# EAGLE design led driver3 (EAGLE 6.2)
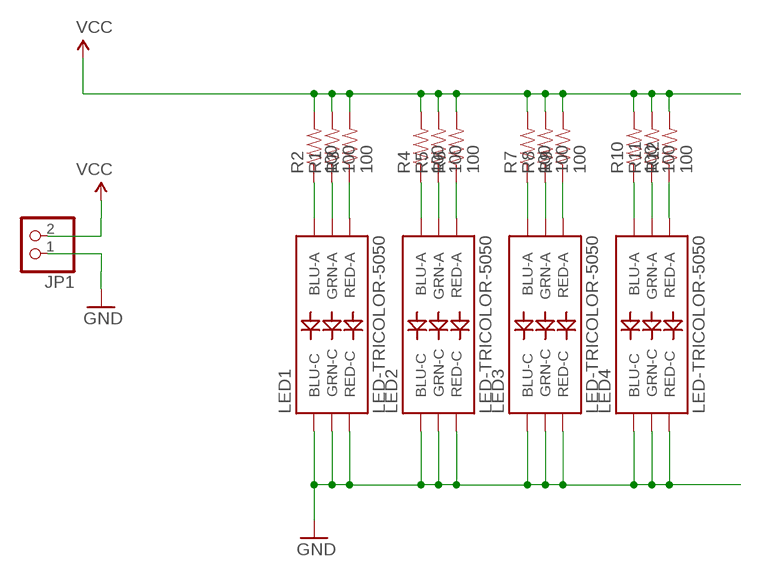
[diagram p0: schematic, sheet 1]

## Parts
JP1  PINHD-1X2  [1X02]
LED1  LED-TRICOLOR-5050  [LED-TRICOLOR-5050]
LED2  LED-TRICOLOR-5050  [LED-TRICOLOR-5050]
LED3  LED-TRICOLOR-5050  [LED-TRICOLOR-5050]
LED4  LED-TRICOLOR-5050  [LED-TRICOLOR-5050]
R1  100  RESISTOR0603-RES  [0603-RES]
R2  100  RESISTOR0603-RES  [0603-RES]
R3  100  RESISTOR0603-RES  [0603-RES]
R4  100  RESISTOR0603-RES  [0603-RES]
R5  100  RESISTOR0603-RES  [0603-RES]
R6  100  RESISTOR0603-RES  [0603-RES]
R7  100  RESISTOR0603-RES  [0603-RES]
R8  100  RESISTOR0603-RES  [0603-RES]
R9  100  RESISTOR0603-RES  [0603-RES]
R10  100  RESISTOR0603-RES  [0603-RES]
R11  100  RESISTOR0603-RES  [0603-RES]
R12  100  RESISTOR0603-RES  [0603-RES]

## Nets
GND: JP1.1 LED1.4(BLU-C) LED1.5(RED-C) LED1.6(GRN-C) LED2.4(BLU-C) LED2.5(RED-C) LED2.6(GRN-C) LED3.4(BLU-C) LED3.5(RED-C) LED3.6(GRN-C) LED4.4(BLU-C) LED4.5(RED-C) LED4.6(GRN-C)
N$1: LED2.3(BLU-A) R4.1
N$2: LED2.1(GRN-A) R5.1
N$3: LED2.2(RED-A) R6.1
N$4: LED3.3(BLU-A) R7.1
N$5: LED3.1(GRN-A) R8.1
N$6: LED3.2(RED-A) R9.1
N$7: LED4.3(BLU-A) R10.1
N$8: LED4.1(GRN-A) R11.1
N$9: LED4.2(RED-A) R12.1
N$20: LED1.3(BLU-A) R2.1
N$21: LED1.1(GRN-A) R1.1
N$22: LED1.2(RED-A) R3.1
VCC: JP1.2 R1.2 R2.2 R3.2 R4.2 R5.2 R6.2 R7.2 R8.2 R9.2 R10.2 R11.2 R12.2

## Library data of the parts
JP1 = pinhead:PINHD-1X2: PIN HEADER
LED1-LED4 = SparkFun:LED-TRICOLOR-5050
R1-R12 = SparkFun:RESISTOR: Resistor Basic schematic elements and footprints for 0603, 1206, and PTH resistors.

## Board
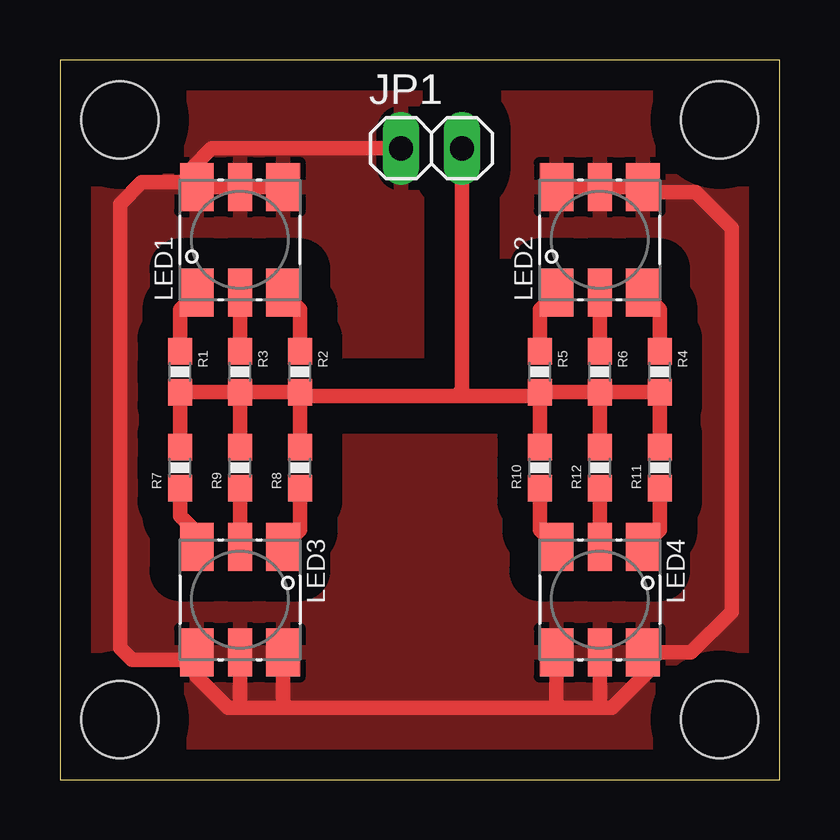
[diagram p1: board, top side]

Size 30 x 30 mm. Coordinates in mm from the lower left corner, seen from the top.
Outline: 0,0 30,0 30,30 0,30 0,0
Copper layers (1*16): Top 0.035mm / dielectric 1.5mm / Bottom 0.035mm
Design rules: minimum track width 10mil, minimum drill 24mil, track to track 8mil, track to pad 8mil, pad to pad 8mil, via to via 8mil, smd to smd 8mil, copper to edge 40mil, drill to drill 8mil, minimum pad ring 10mil, minimum via ring 8mil, stop-mask expansion 4mil, vias tented up to drill 0mil, thermal gap 10mil
Holes 3.2 mm at 2.5,2.5 2.5,27.5 27.5,27.5 27.5,2.5

### Footprints (pad centres in the part's own frame; a part is rotated, then mirrored left to right if it is on the bottom)
1X02 = drill 1.016 long: 1 -1.27,0; 2 1.27,0
LED-TRICOLOR-5050 = smd 2 x 1.4: 1 -2.2,1.8; 3 -2.2,-1.8; 4 2.2,-1.8; 6 2.2,1.8 | smd 2 x 1: 2 -2.2,0; 5 2.2,0
0603-RES = smd 1.1 x 1: 1 -0.85,0; 2 0.85,0

### Placement (x,y rotation side)
JP1  15.49,26.32 0 top
LED1  7.5,22.5 90 top
LED2  22.5,22.5 90 top
LED3  7.5,7.5 270 top
LED4  22.5,7.5 270 top
R1  5,17 270 top
R2  10,17 270 top
R3  7.5,17 270 top
R4  25,17 270 top
R5  20,17 270 top
R6  22.5,17 270 top
R7  5,13 90 top
R8  10,13 90 top
R9  7.5,13 90 top
R10  20,13 90 top
R11  25,13 90 top
R12  22.5,13 90 top

### Tracks (layer width: path | path; a pad name or v marks a point on that pad's centre or on a via)
GND
  Top 0.61: JP1.1 6.32,26.32 5.5,25.5 5.5,24.9 | 5.5,24.9 LED1.6 LED1.5 LED1.4 | 7.5,3 7,3 5.7,4.3 LED3.4 5.4,5 3,5 2.5,5.5 2.5,24 3.4,24.9 5.5,24.9 | 7.5,3 9.5,3 | 9.5,3 20.5,3 | 20.5,3 22.5,3 | 22.5,3 23,3 24.5,4.5 24.5,5.1 LED4.6 26.3,5.3 28,7 28,23 26.5,24.5 24.5,24.5 LED2.4 LED2.5 LED2.6 | LED4.5 22.5,3 | LED4.4 20.7,3.2 20.5,3 | LED3.6 9.3,3.2 9.5,3 | LED3.5 7.5,3
  pour Top (isolate 1.27): 0,30 30,30 30,0 0,0
N$1
  Top 0.61: R4.1 25,19.6 LED2.3
N$2
  Top 0.61: R5.1 20,19.6 LED2.1
N$3
  Top 0.61: R6.1 LED2.2
N$4
  Top 0.61: LED3.3 5.7,10.3 5,11 R7.1
N$5
  Top 0.61: R8.1 10,10.4 LED3.1
N$6
  Top 0.61: R9.1 LED3.2
N$7
  Top 0.61: R10.1 20,10.4 LED4.3
N$8
  Top 0.61: R11.1 25,10.4 LED4.1
N$9
  Top 0.61: R12.1 LED4.2
N$20
  Top 0.61: R2.1 10,19.6 LED1.3
N$21
  Top 0.61: R1.1 5,19.6 LED1.1
N$22
  Top 0.61: R3.1 LED1.2
VCC
  Top 0.61: R7.2 R1.2 R3.2 | R3.2 R9.2 | 10,16 R8.2 | R3.2 R2.2 10,16 | R11.2 R4.2 R6.2 | R12.2 R6.2 | R10.2 R5.2 | R6.2 R5.2 | 10,16 16.5,16 | 16.5,16 19.85,16 R5.2 | JP1.2 16.76,16.26 16.5,16